# EAGLE design Nixie_Clock_LED_Board (EAGLE 9.6.2)

## Sheet 1 of 2
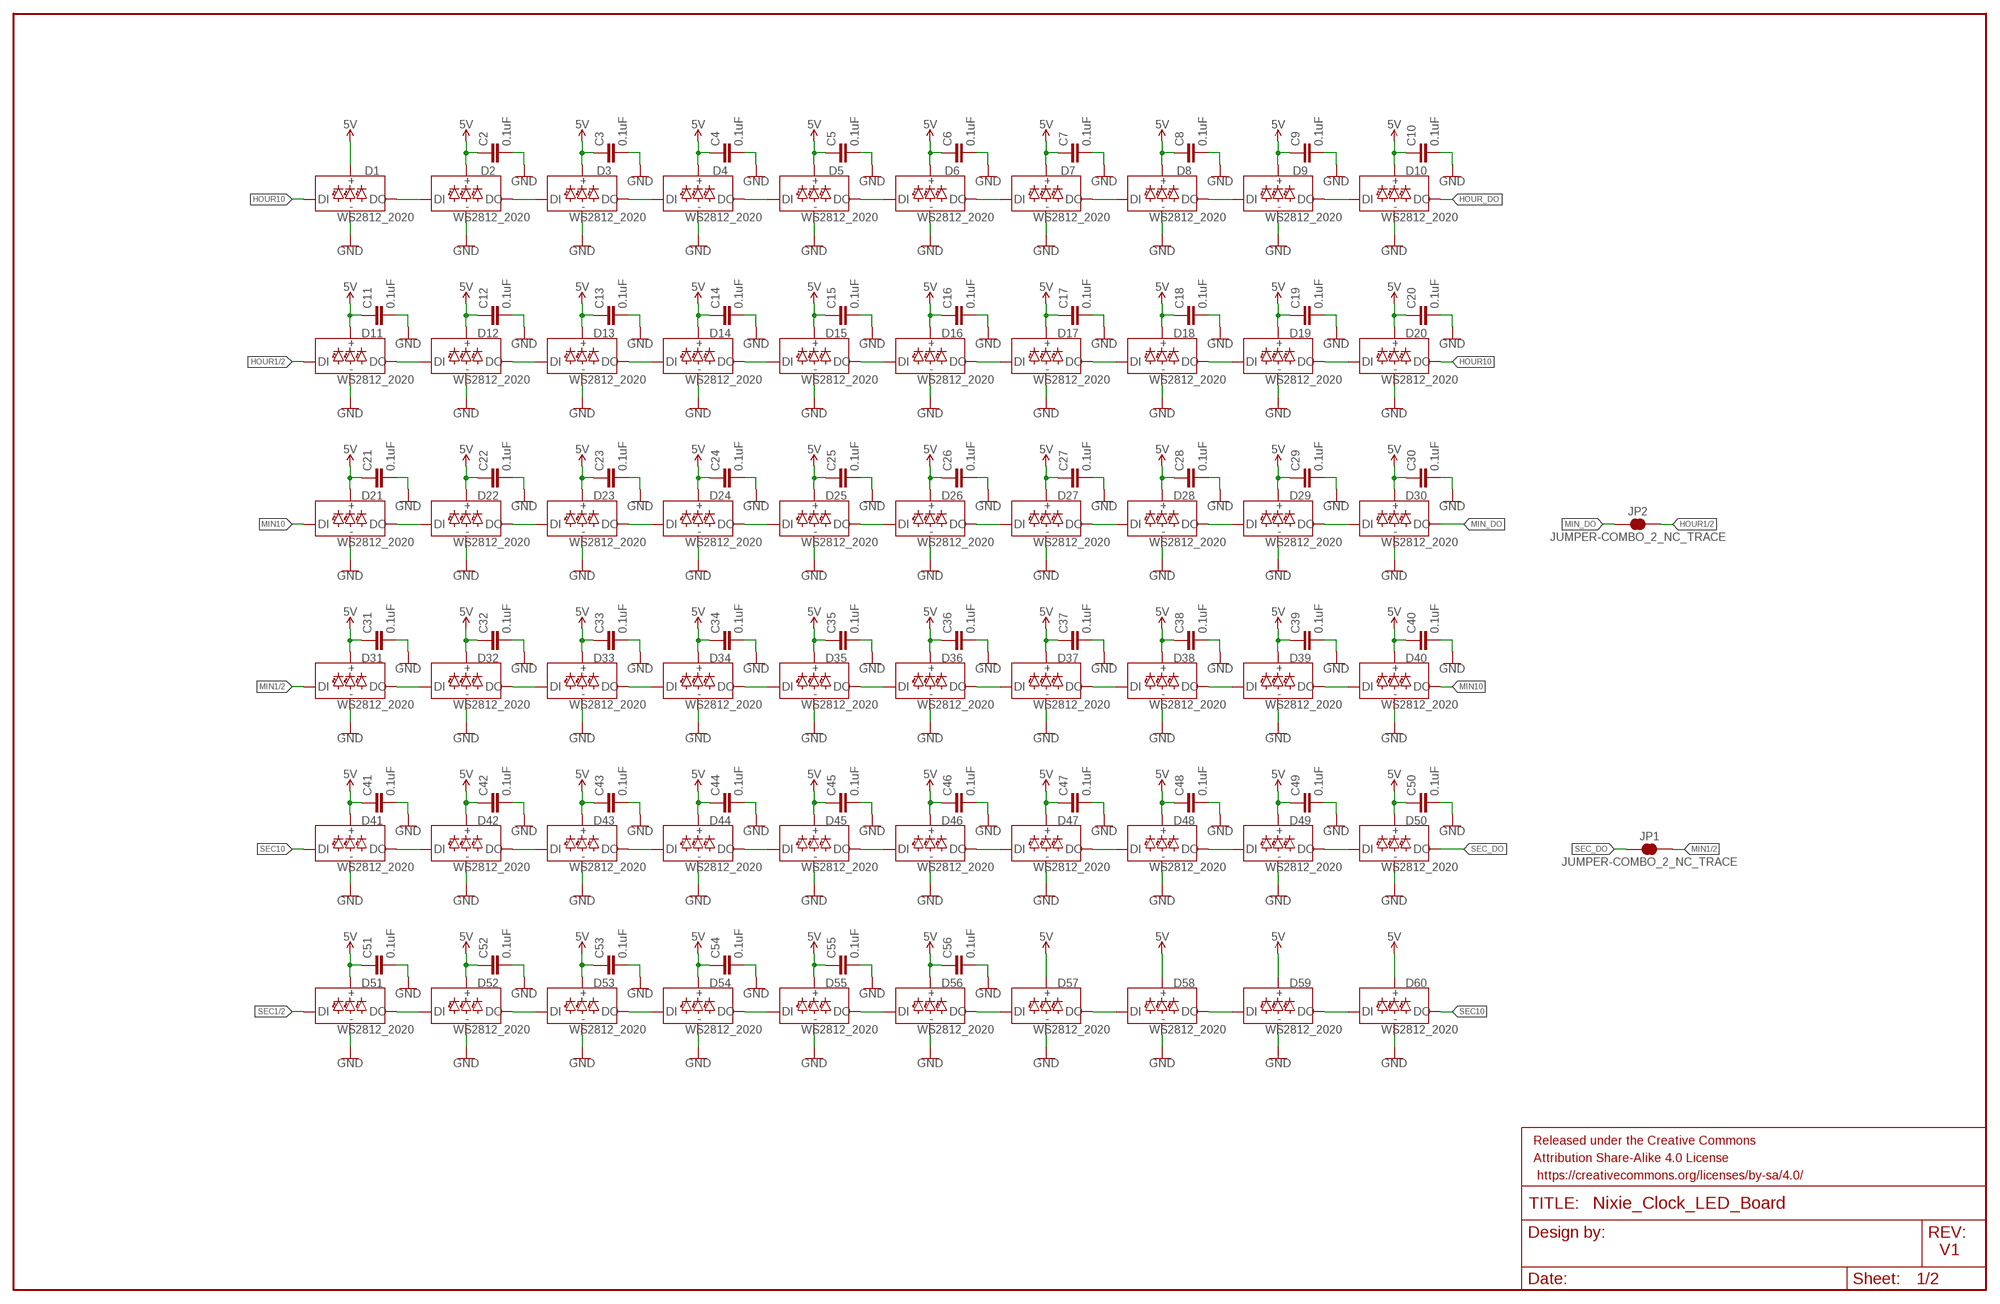
[diagram p0: schematic, sheet 1]

### Parts
C2  0.1uF  0.1UF-0603-25V-5%  [0603]
C3  0.1uF  0.1UF-0603-25V-5%  [0603]
C4  0.1uF  0.1UF-0603-25V-5%  [0603]
C5  0.1uF  0.1UF-0603-25V-5%  [0603]
C6  0.1uF  0.1UF-0603-25V-5%  [0603]
C7  0.1uF  0.1UF-0603-25V-5%  [0603]
C8  0.1uF  0.1UF-0603-25V-5%  [0603]
C9  0.1uF  0.1UF-0603-25V-5%  [0603]
C10  0.1uF  0.1UF-0603-25V-5%  [0603]
C11  0.1uF  0.1UF-0603-25V-5%  [0603]
C12  0.1uF  0.1UF-0603-25V-5%  [0603]
C13  0.1uF  0.1UF-0603-25V-5%  [0603]
C14  0.1uF  0.1UF-0603-25V-5%  [0603]
C15  0.1uF  0.1UF-0603-25V-5%  [0603]
C16  0.1uF  0.1UF-0603-25V-5%  [0603]
C17  0.1uF  0.1UF-0603-25V-5%  [0603]
C18  0.1uF  0.1UF-0603-25V-5%  [0603]
C19  0.1uF  0.1UF-0603-25V-5%  [0603]
C20  0.1uF  0.1UF-0603-25V-5%  [0603]
C21  0.1uF  0.1UF-0603-25V-5%  [0603]
C22  0.1uF  0.1UF-0603-25V-5%  [0603]
C23  0.1uF  0.1UF-0603-25V-5%  [0603]
C24  0.1uF  0.1UF-0603-25V-5%  [0603]
C25  0.1uF  0.1UF-0603-25V-5%  [0603]
C26  0.1uF  0.1UF-0603-25V-5%  [0603]
C27  0.1uF  0.1UF-0603-25V-5%  [0603]
C28  0.1uF  0.1UF-0603-25V-5%  [0603]
C29  0.1uF  0.1UF-0603-25V-5%  [0603]
C30  0.1uF  0.1UF-0603-25V-5%  [0603]
C31  0.1uF  0.1UF-0603-25V-5%  [0603]
C32  0.1uF  0.1UF-0603-25V-5%  [0603]
C33  0.1uF  0.1UF-0603-25V-5%  [0603]
C34  0.1uF  0.1UF-0603-25V-5%  [0603]
C35  0.1uF  0.1UF-0603-25V-5%  [0603]
C36  0.1uF  0.1UF-0603-25V-5%  [0603]
C37  0.1uF  0.1UF-0603-25V-5%  [0603]
C38  0.1uF  0.1UF-0603-25V-5%  [0603]
C39  0.1uF  0.1UF-0603-25V-5%  [0603]
C40  0.1uF  0.1UF-0603-25V-5%  [0603]
C41  0.1uF  0.1UF-0603-25V-5%  [0603]
C42  0.1uF  0.1UF-0603-25V-5%  [0603]
C43  0.1uF  0.1UF-0603-25V-5%  [0603]
C44  0.1uF  0.1UF-0603-25V-5%  [0603]
C45  0.1uF  0.1UF-0603-25V-5%  [0603]
C46  0.1uF  0.1UF-0603-25V-5%  [0603]
C47  0.1uF  0.1UF-0603-25V-5%  [0603]
C48  0.1uF  0.1UF-0603-25V-5%  [0603]
C49  0.1uF  0.1UF-0603-25V-5%  [0603]
C50  0.1uF  0.1UF-0603-25V-5%  [0603]
C51  0.1uF  0.1UF-0603-25V-5%  [0603]
C52  0.1uF  0.1UF-0603-25V-5%  [0603]
C53  0.1uF  0.1UF-0603-25V-5%  [0603]
C54  0.1uF  0.1UF-0603-25V-5%  [0603]
C55  0.1uF  0.1UF-0603-25V-5%  [0603]
C56  0.1uF  0.1UF-0603-25V-5%  [0603]
D1  WS2812_2020  [WS2812-2020]
D2  WS2812_2020  [WS2812-2020]
D3  WS2812_2020  [WS2812-2020]
D4  WS2812_2020  [WS2812-2020]
D5  WS2812_2020  [WS2812-2020]
D6  WS2812_2020  [WS2812-2020]
D7  WS2812_2020  [WS2812-2020]
D8  WS2812_2020  [WS2812-2020]
D9  WS2812_2020  [WS2812-2020]
D10  WS2812_2020  [WS2812-2020]
D11  WS2812_2020  [WS2812-2020]
D12  WS2812_2020  [WS2812-2020]
D13  WS2812_2020  [WS2812-2020]
D14  WS2812_2020  [WS2812-2020]
D15  WS2812_2020  [WS2812-2020]
D16  WS2812_2020  [WS2812-2020]
D17  WS2812_2020  [WS2812-2020]
D18  WS2812_2020  [WS2812-2020]
D19  WS2812_2020  [WS2812-2020]
D20  WS2812_2020  [WS2812-2020]
D21  WS2812_2020  [WS2812-2020]
D22  WS2812_2020  [WS2812-2020]
D23  WS2812_2020  [WS2812-2020]
D24  WS2812_2020  [WS2812-2020]
D25  WS2812_2020  [WS2812-2020]
D26  WS2812_2020  [WS2812-2020]
D27  WS2812_2020  [WS2812-2020]
D28  WS2812_2020  [WS2812-2020]
D29  WS2812_2020  [WS2812-2020]
D30  WS2812_2020  [WS2812-2020]
D31  WS2812_2020  [WS2812-2020]
D32  WS2812_2020  [WS2812-2020]
D33  WS2812_2020  [WS2812-2020]
D34  WS2812_2020  [WS2812-2020]
D35  WS2812_2020  [WS2812-2020]
D36  WS2812_2020  [WS2812-2020]
D37  WS2812_2020  [WS2812-2020]
D38  WS2812_2020  [WS2812-2020]
D39  WS2812_2020  [WS2812-2020]
D40  WS2812_2020  [WS2812-2020]
D41  WS2812_2020  [WS2812-2020]
D42  WS2812_2020  [WS2812-2020]
D43  WS2812_2020  [WS2812-2020]
D44  WS2812_2020  [WS2812-2020]
D45  WS2812_2020  [WS2812-2020]
D46  WS2812_2020  [WS2812-2020]
D47  WS2812_2020  [WS2812-2020]
D48  WS2812_2020  [WS2812-2020]
D49  WS2812_2020  [WS2812-2020]
D50  WS2812_2020  [WS2812-2020]
D51  WS2812_2020  [WS2812-2020]
D52  WS2812_2020  [WS2812-2020]
D53  WS2812_2020  [WS2812-2020]
D54  WS2812_2020  [WS2812-2020]
D55  WS2812_2020  [WS2812-2020]
D56  WS2812_2020  [WS2812-2020]
D57  WS2812_2020  [WS2812-2020]
D58  WS2812_2020  [WS2812-2020]
D59  WS2812_2020  [WS2812-2020]
D60  WS2812_2020  [WS2812-2020]
FRAME2  FRAME-LEDGER  [CREATIVE_COMMONS]
JP1  JUMPER-COMBO_2_NC_TRACE  [COMBO-JUMPER_2_NC_TRACE]
JP2  JUMPER-COMBO_2_NC_TRACE  [COMBO-JUMPER_2_NC_TRACE]

### Nets
5V: C2.1 C3.1 C4.1 C5.1 C6.1 C7.1 C8.1 C9.1 C10.1 C11.1 C12.1 C13.1 C14.1 C15.1 C16.1 C17.1 C18.1 C19.1 C20.1 C21.1 C22.1 C23.1 C24.1 C25.1 C26.1 C27.1 C28.1 C29.1 C30.1 C31.1 C32.1 C33.1 C34.1 C35.1 C36.1 C37.1 C38.1 C39.1 C40.1 C41.1 C42.1 C43.1 C44.1 C45.1 C46.1 C47.1 C48.1 C49.1 C50.1 C51.1 C52.1 C53.1 C54.1 C55.1 C56.1 D1.VCC D2.VCC D3.VCC D4.VCC D5.VCC D6.VCC D7.VCC D8.VCC D9.VCC D10.VCC D11.VCC D12.VCC D13.VCC D14.VCC D15.VCC D16.VCC D17.VCC D18.VCC D19.VCC D20.VCC D21.VCC D22.VCC D23.VCC D24.VCC D25.VCC D26.VCC D27.VCC D28.VCC D29.VCC D30.VCC D31.VCC D32.VCC D33.VCC D34.VCC D35.VCC D36.VCC D37.VCC D38.VCC D39.VCC D40.VCC D41.VCC D42.VCC D43.VCC D44.VCC D45.VCC D46.VCC D47.VCC D48.VCC D49.VCC D50.VCC D51.VCC D52.VCC D53.VCC D54.VCC D55.VCC D56.VCC D57.VCC D58.VCC D59.VCC D60.VCC ; also sheet 2
GND: C2.2 C3.2 C4.2 C5.2 C6.2 C7.2 C8.2 C9.2 C10.2 C11.2 C12.2 C13.2 C14.2 C15.2 C16.2 C17.2 C18.2 C19.2 C20.2 C21.2 C22.2 C23.2 C24.2 C25.2 C26.2 C27.2 C28.2 C29.2 C30.2 C31.2 C32.2 C33.2 C34.2 C35.2 C36.2 C37.2 C38.2 C39.2 C40.2 C41.2 C42.2 C43.2 C44.2 C45.2 C46.2 C47.2 C48.2 C49.2 C50.2 C51.2 C52.2 C53.2 C54.2 C55.2 C56.2 D1.GND D2.GND D3.GND D4.GND D5.GND D6.GND D7.GND D8.GND D9.GND D10.GND D11.GND D12.GND D13.GND D14.GND D15.GND D16.GND D17.GND D18.GND D19.GND D20.GND D21.GND D22.GND D23.GND D24.GND D25.GND D26.GND D27.GND D28.GND D29.GND D30.GND D31.GND D32.GND D33.GND D34.GND D35.GND D36.GND D37.GND D38.GND D39.GND D40.GND D41.GND D42.GND D43.GND D44.GND D45.GND D46.GND D47.GND D48.GND D49.GND D50.GND D51.GND D52.GND D53.GND D54.GND D55.GND D56.GND D57.GND D58.GND D59.GND D60.GND ; also sheet 2
HOUR1: D11.DI JP2.2 JP2.4 ; also sheet 2
HOUR10: D1.DI D20.DO
HOUR_DO: D10.DO
MIN1: D31.DI JP1.2 JP1.4 ; also sheet 2
MIN10: D21.DI D40.DO
MIN_DO: D30.DO JP2.1 JP2.3
N$1: D1.DO D2.DI
N$2: D2.DO D3.DI
N$3: D3.DO D4.DI
N$4: D4.DO D5.DI
N$5: D5.DO D6.DI
N$6: D6.DO D7.DI
N$7: D7.DO D8.DI
N$8: D8.DO D9.DI
N$9: D9.DO D10.DI
N$10: D11.DO D12.DI
N$11: D12.DO D13.DI
N$12: D13.DO D14.DI
N$13: D14.DO D15.DI
N$14: D15.DO D16.DI
N$15: D16.DO D17.DI
N$16: D17.DO D18.DI
N$17: D18.DO D19.DI
N$18: D19.DO D20.DI
N$19: D41.DO D42.DI
N$20: D21.DO D22.DI
N$21: D22.DO D23.DI
N$22: D23.DO D24.DI
N$23: D24.DO D25.DI
N$24: D25.DO D26.DI
N$25: D26.DO D27.DI
N$26: D27.DO D28.DI
N$27: D28.DO D29.DI
N$28: D29.DO D30.DI
N$29: D31.DO D32.DI
N$30: D32.DO D33.DI
N$31: D33.DO D34.DI
N$32: D34.DO D35.DI
N$33: D35.DO D36.DI
N$34: D36.DO D37.DI
N$35: D37.DO D38.DI
N$36: D38.DO D39.DI
N$37: D39.DO D40.DI
N$38: D42.DO D43.DI
N$39: D43.DO D44.DI
N$40: D44.DO D45.DI
N$41: D45.DO D46.DI
N$42: D46.DO D47.DI
N$43: D47.DO D48.DI
N$44: D48.DO D49.DI
N$45: D49.DO D50.DI
N$46: D51.DO D52.DI
N$47: D52.DO D53.DI
N$48: D53.DO D54.DI
N$49: D54.DO D55.DI
N$50: D55.DO D56.DI
N$51: D56.DO D57.DI
N$52: D57.DO D58.DI
N$53: D58.DO D59.DI
N$54: D59.DO D60.DI
SEC1: D51.DI ; also sheet 2
SEC10: D41.DI D60.DO
SEC_DO: D50.DO JP1.1 JP1.3

### Notes on the sheet
- V1

## Sheet 2 of 2
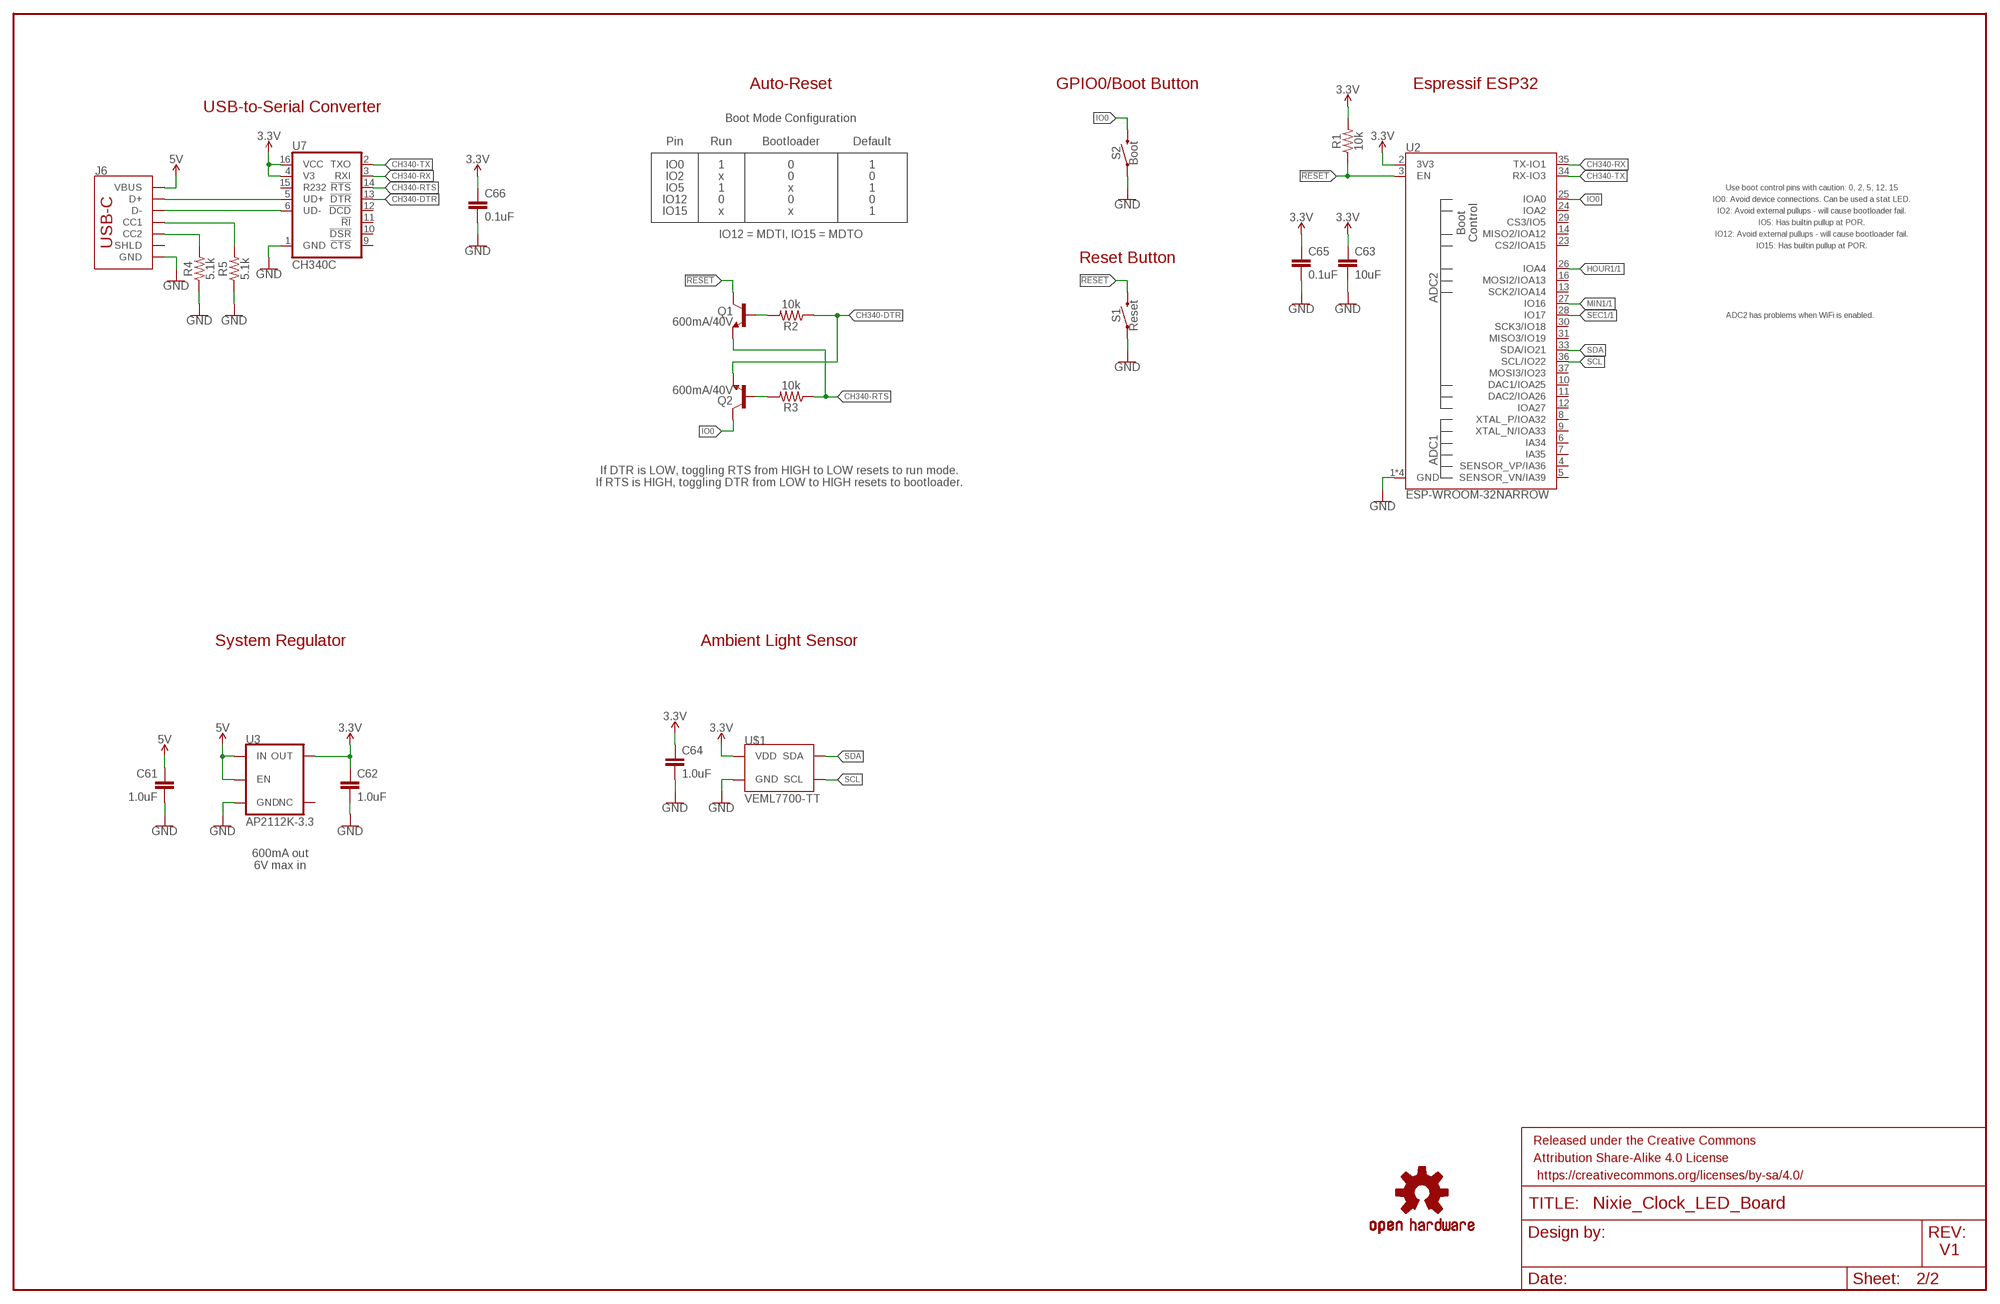
[diagram p1: schematic, sheet 2]

### Parts
C61  1.0uF  1.0UF-0603-16V-10%-X7R  [0603]
C62  1.0uF  1.0UF-0603-16V-10%-X7R  [0603]
C63  10uF  10UF-0603-6.3V-20%  [0603]
C64  1.0uF  1.0UF-0603-16V-10%-X7R  [0603]
C65  0.1uF  0.1UF-0603-25V-5%  [0603]
C66  0.1uF  0.1UF-0603-25V-5%  [0603]
FRAME1  FRAME-LEDGER  [CREATIVE_COMMONS]
J6  USB_C_2-LAYER_PADS  [USB-C-16P-2LAYER-PADS]
LOGO2  OSHW-LOGOL  [OSHW-LOGO-L]
Q1  600mA/40V  TRANS_NPN-MMBT2222AL  [SOT23-3]
Q2  600mA/40V  TRANS_NPN-MMBT2222AL  [SOT23-3]
R1  10k  10KOHM-0603-1/10W-1%  [0603]
R2  10k  10KOHM-0603-1/10W-1%  [0603]
R3  10k  10KOHM-0603-1/10W-1%  [0603]
R4  5.1k  5.1KOHM5.1KOHM-0603-1/10W-1%  [0603]
R5  5.1k  5.1KOHM5.1KOHM-0603-1/10W-1%  [0603]
S1  Reset  MOMENTARY-SWITCH-SPST-SMD-5.2MM-TALL  [TACTILE_SWITCH_SMD_5.2MM]
S2  Boot  MOMENTARY-SWITCH-SPST-SMD-5.2MM-TALL  [TACTILE_SWITCH_SMD_5.2MM]
U2  ESP-WROOM-32NARROW  [ESP-WROOM-32-NARROW]
U3  AP2112K-3.3  V_REG_AP2112K-3.3V  [SOT23-5]
U7  CH340C  [SO016]
U$1  VEML7700-TT  [VEML7700_TT]

### Nets
3.3V: C62.1 C63.1 C64.1 C65.1 C66.1 R1.2 U2.2(3V3) U3.5(OUT) U7.4(V3) U7.16(VCC) U$1.2(VDD)
5V: C61.1 J6.VBUS1(VBUS) J6.VBUS2(VBUS) U3.1(IN) U3.3(EN) ; also sheet 1
!RESET!: Q1.3(C) R1.1 S1.3 U2.3(EN)
CH340-DTR: Q2.2(E) R2.1 U7.13(!DTR)
CH340-RTS: Q1.2(E) R3.1 U7.14(!RTS)
CH340-RX: U2.35(TX-IO1) U7.3(RXI)
CH340-TX: U2.34(RX-IO3) U7.2(TXO)
D+: J6.A6(D+) J6.B6(D+) U7.5(UD+)
D-: J6.A7(D-) J6.B7(D-) U7.6(UD-)
GND: C61.2 C62.2 C63.2 C64.2 C65.2 C66.2 J6.GND J6.GND2(GND) R4.1 R5.1 S1.1 S2.1 U2.1(GND) U2.15(GND) U2.38(GND) U2.GND U3.2(GND) U7.1(GND) U$1.3(GND) ; also sheet 1
HOUR1: U2.26(IOA4) ; also sheet 1
IO0: Q2.3(C) S2.3 U2.25(IOA0)
MIN1: U2.27(IO16) ; also sheet 1
N$55: Q2.1(B) R3.2
N$56: Q1.1(B) R2.2
N$57: J6.B5(CC2) R4.2
N$58: J6.A5(CC1) R5.2
SCL: U2.36(SCL/IO22) U$1.1(SCL)
SDA: U2.33(SDA/IO21) U$1.4(SDA)
SEC1: U2.28(IO17) ; also sheet 1
Unconnected: J6.SHLD1(SHLD) J6.SHLD2(SHLD) J6.SHLD3(SHLD) J6.SHLD4(SHLD) U2.4(SENSOR_VP/IA36) U2.5(SENSOR_VN/IA39) U2.6(IA34) U2.7(IA35) U2.8(XTAL_P/IOA32) U2.9(XTAL_N/IOA33) U2.10(DAC1/IOA25) U2.11(DAC2/IOA26) U2.12(IOA27) U2.13(SCK2/IOA14) U2.14(MISO2/IOA12) U2.16(MOSI2/IOA13) U2.23(CS2/IOA15) U2.24(IOA2) U2.29(CS3/IO5) U2.30(SCK3/IO18) U2.31(MISO3/IO19) U2.37(MOSI3/IO23) U3.4(NC) U7.9(!CTS) U7.10(!DSR) U7.11(!RI) U7.12(!DCD) U7.15(R232)

### Notes on the sheet
- Auto-Reset | GPIO0/Boot Button | Espressif ESP32
- USB-to-Serial Converter
- Boot Mode Configuration
- Pin | Run | Bootloader | Default
- IO0 | 1 | 0 | 1
- IO2 | x | 0 | 0
- IO5 | 1 | x | 1 | Use boot control pins with caution: 0, 2, 5, 12, 15
- IO12 | 0 | 0 | 0 | IO0: Avoid device connections. Can be used a stat LED.
- IO15 | x | x | 1 | IO2: Avoid external pullups - will cause bootloader fail.
- IO5: Has builtin pullup at POR.
- IO12 = MDTI, IO15 = MDTO | IO12: Avoid external pullups - will cause bootloader fail.
- IO15: Has builtin pullup at POR.
- Reset Button
- ADC2 has problems when WiFi is enabled.
- If DTR is LOW, toggling RTS from HIGH to LOW resets to run mode.
  If RTS is HIGH, toggling DTR from LOW to HIGH resets to bootloader.
- System Regulator | Ambient Light Sensor
- 600mA out
  6V max in
- V1

## Library data of the parts
C2-C56 C65 C66 = SparkFun-Capacitors:0.1UF: 0.1µF ceramic capacitors A capacitor is a passive two-terminal electrical component used to store electrical energy temporarily in an electric field.; PROD_ID: CAP-08604
C61 C62 C64 = SparkFun-Capacitors:1.0UF: 1µF ceramic capacitors A capacitor is a passive two-terminal electrical component used to store electrical energy temporarily in an electric field.; PROD_ID: CAP-13930
C63 = SparkFun-Capacitors:10UF: 10.0µF ceramic capacitors A capacitor is a passive two-terminal electrical component used to store electrical energy temporarily in an electric field.; PROD_ID: CAP-11015
D1-D60 = SparkFun-LED:WS2812: Addressable RGB LED - 1 Wire Common names: WS2812, SK6812, Neopixel, APA-106, etc. SMD LED with built-in controller IC. Color: Red/Green/Blue SparkFun Products: LED-SMD RGB (WS2812) <https://www.sparkfun.com/products/11821> LED - RGB Addressable, PTH, 5mm Diffused (5 Pack) <https://www.sparkfun.com/products/12986> LED - RGB Addressable, PTH, 5mm Clear (5 Pack) <https://www.sparkfun.com/products/12999> Blynk Board - ESP8266 <https://www.sparkfun.com/products/13794> Datasheet referenced for footprint: WS2812B-PTH <https://cdn.sparkfun.com/datasheets/Components/LED/COM-12877.pdf>; PROD_ID: DIO-15591
FRAME1 FRAME2 = SparkFun-Aesthetics:FRAME-LEDGER: Schematic Frame - Ledger Standard 11x14 US Ledger frame
J6 = SparkFun-Connectors:USB_C: USB Type C 16Pin Connector Super Speed pins not available on the 16-pin purely SMD connector so this part is best for USB 2.0 implementations. D1 and D2 are tied together enabling D+/- no matter which way the cable is plugged into the connector. The two channel configuration pins (CC1/2) are exposed. These are normally connected to ground via 5.1k resistors but can be reconfigured for high current/high power applications. **4-LAYER BOARD WARNING!!** If designing 4-layer board, make sure to select the variant _4-LAYER-ISOLATED. The linked footprint (USB-C-16-4LAYER-ISOLATED) includes some very necessary cutout polygons in the inner layers (2 and 15). This prevents the PTH mounting shield legs on the USB connector from electrically connecting any other polygons on the inner layers (usually VCC and GND).; PROD_ID: CONN-14122
JP1 JP2 = SparkFun-Jumpers:JUMPER-COMBO_2_NC_TRACE
LOGO2 = SparkFun-Aesthetics:OSHW-LOGO: Open-Source Hardware (OSHW) Logo This logo indicates the piece of hardware it is found on incorporates a OSHW license and/or adheres to the definition of open source hardware found here: http://freedomdefined.org/OSHW
Q1 Q2 = SparkFun-DiscreteSemi:TRANS_NPN: NPN transistor Current controlled devices typically used to amplify current or used as a switch. BC547 - COM-08928 <http://www.sparkfun.com/products/8928> (TO-92 45V 100mA) (1.Collector 2.Base 3.Emitter) 2N3904 - COM-00521 <http://www.sparkfun.com/products/521> (TO-92 40V 200mA) (1.Emitter 2.Base 3.Collector) P2N2222A - COM-12852 <http://www.sparkfun.com/products/12852> (TO-92 40V 600mA) (1.Collector 2.Base 3.Emitter); PROD_ID: TRANS-08049
R1-R3 = SparkFun-Resistors:10KOHM: 10kΩ resistor A resistor is a passive two-terminal electrical component that implements electrical resistance as a circuit element. Resistors act to reduce current flow, and, at the same time, act to lower voltage levels within circuits. - Wikipedia; PROD_ID: RES-00824
R4 R5 = SparkFun-Resistors:5.1KOHM; PROD_ID: RES-12083
S1 S2 = SparkFun-Switches:MOMENTARY-SWITCH-SPST: Momentary Switch (Pushbutton) - SPST Normally-open (NO) SPST momentary switches (buttons, pushbuttons). Variants PTH-12MM - 12mm square, through-hole Momentary Pushbutton Switch - 12mm Square <https://www.sparkfun.com/products/9190> (COM-09190) PTH-6.0MM, PTH-6.0MM-KIT - 6.0mm square, through-hole Mini Pushbutton Switch <https://www.sparkfun.com/products/97> (COM-00097) KIT package intended for soldering kit's - only one side of pads' copper is exposed. PTH-RIGHT-ANGLE-KIT - Right-angle, through-hole Right Angle Tactile Button <https://www.sparkfun.com/products/10791> - Used on SparkFun BigTime Watch Kit <https://www.sparkfun.com/products/11734> SMD-12MM - 12mm square, surface-mount Tactile Button - SMD (12mm) <https://www.sparkfun.com/products/12993> (COM-12993) Used on SparkFun PicoBoard <https://www.sparkfun.com/products/11888> SMD-4.5MM - 4.5mm Square Trackball Switch Used on SparkFun Blackberry Trackballer Breakout <https://www.sparkfun.com/products/13169> SMD-4.6MMX2.8MM - 4.60mm x 2.80mm, surface mount Used on SparkFun Pro Micro - RP2040 <https://www.sparkfun.com/products/17717> SMD-5.2MM, SMD-5.2-REDUNDANT - 5.2mm square, surface-mount Mini Pushbutton Switch - SMD <https://www.sparkfun.com/products/8720> (COM-08720) Used on Arduino Pro Mini <https://www.sparkfun.com/products/11114> REDUNDANT package connects both switch circuits together SMD-6.0X3.5MM - 6.0 x 3.5mm, surface mount Momentary Reset Switch SMD <https://www.sparkfun.com/products/8229> (COM-08229) SMD-6.2MM-TALL - 6.2mm square, surface mount Tactile Button - SMD (6mm) <https://www.sparkfun.com/products/12992> Used on SparkFun Digital Sandbox <https://www.sparkfun.com/products/12651> SMD-RIGHT-ANGLE - Right-angle, surface mount Used on SparkFun Block for Intel® Edison - Arduino <https://www.sparkfun.com/products/13036>; PROD_ID: SWCH-14139
U2 = SparkFun-RF:ESP-WROOM-32; PROD_ID: IC-13849
U3 = SparkFun-IC-Power:V_REG_AP2112: AP2112 - 600mA CMOS LDO Regulator w/ Enable The AP2112 is CMOS process low dropout linear regulator with enable function, the regulator delivers a guaranteed 600mA (min.) continuous load current. Features Output Voltage Accuracy: ±1.5% Output Current: 600mA (Min.) Foldback Short Current Protection: 50mA Enable Function to Turn ON/OFF VOUT Low Dropout Voltage (3.3V): 250mV (Typ.) @IOUT=600mA Excellent Load Regulation: 0.2%/A (Typ.) Excellent Line Regulation: 0.02%/V (Typ.) Low Quiescent Current: 55μA (Typ.) Low Standby Current: 0.01μA (Typ.) Low Output Noise: 50μVRMS PSRR: 100Hz -65dB, 1kHz -65dB OTSD Protection Stable with 1.0μF Flexible Cap: Ceramic, Tantalum and Aluminum Electrolytic Operation Temperature Range: -40°C to 85°C ESD: MM 400V, HBM 4000V; PROD_ID: VREG-12457; VALUE: 3.3V
U7 = SparkFun-IC-Comms:CH340C; PROD_ID: IC-14038
U$1 = SparkFun-Sensors:VEML7700: Vishay VEML7700 Ambient Light Sensor VEML7700-TR is the side-view part VEML7700-TT is the top-view part; PROD_ID: IC-16311

## Net classes
1 power: width 0.305 mm, drill 0.305 mm

## Board
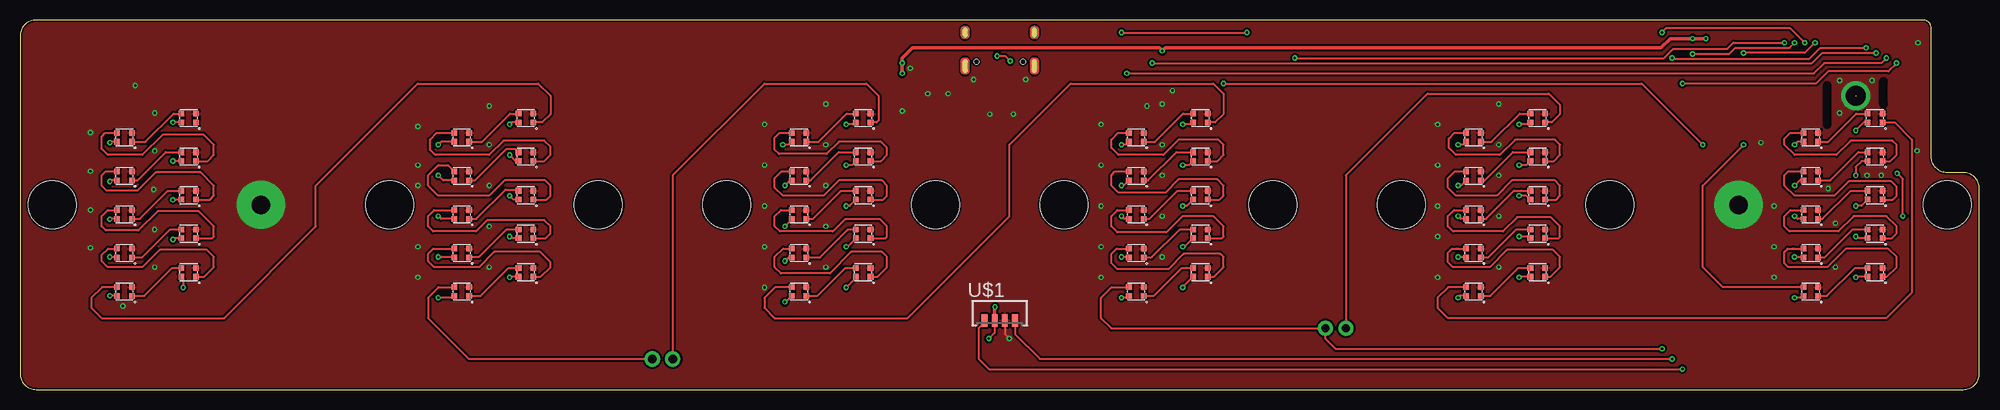
[diagram p2: board, top side]
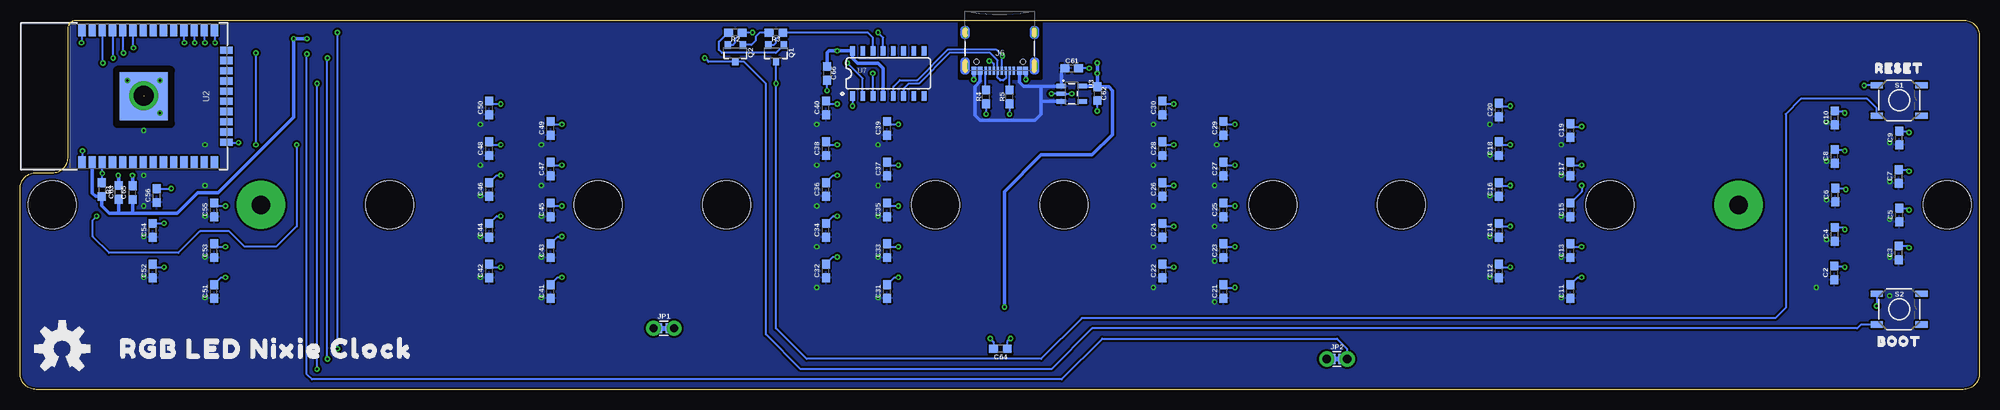
[diagram p3: board, bottom side, seen from below]

Size 244 x 46 mm. Coordinates in mm from the lower left corner, seen from the top.
Outline: 2,0 242,0 arc90 244,2 244,25 arc90 242,27 240,27 arc-90 238,29 238,45 arc90 237,46 2,46 arc90 0,44 0,2 arc90 2,0
Copper layers (1*16): Top 0.035mm / dielectric 1.5mm / Bottom 0.035mm
Design rules "SparkFun-2-Layer-General-JLCPCB": minimum track width 7mil, minimum drill 0.3mm, track to track 7mil, track to pad 7mil, pad to pad 7mil, via to via 7mil, smd to smd 7mil, copper to edge 7mil, drill to drill 7mil, minimum pad ring 7mil, minimum via ring 7mil, stop-mask expansion 3mil, vias tented up to drill 25mil, thermal gap 10mil
Holes 6 mm at 4,23 114,23 130,23 88,23 72,23 46,23 240,23 156,23 172,23 198,23
tRestrict: 2 lines
bRestrict: 4 lines

### Footprints (pad centres in the part's own frame; a part is rotated, then mirrored left to right if it is on the bottom)
0603 = smd 1.1 x 1: 1 -0.85,0; 2 0.85,0
WS2812-2020 = smd 0.7 x 0.7: DI -0.915,0.55; DO 0.915,-0.55; GND 0.915,0.55; VCC -0.915,-0.55
USB-C-16P-2LAYER-PADS = smd 0.3 x 1: A5 -1.25,-0.34; A6 -0.25,-0.34; A7 0.25,-0.34; A8 1.25,-0.34; B5 1.75,-0.34; B6 0.75,-0.34; B7 -0.75,-0.34; B8 -1.75,-0.34 | smd 0.6 x 1: GND -3.225,-0.34; GND2 3.225,-0.34; VBUS1 -2.45,-0.34; VBUS2 2.45,-0.34 | drill 0.4 pad 0.6 long: SHLD1 -4.318,-0.915; SHLD2 4.318,-0.915; SHLD3 -4.318,-5.095; SHLD4 4.318,-5.095 | hole 0.65: -2.89,-1.445; 2.89,-1.445
COMBO-JUMPER_2_NC_TRACE = smd 0.635 x 1.27: 1 -0.508,0; 2 0.508,0 | drill 1.016 pad 1.88: 3 -1.27,0; 4 1.27,0
SOT23-3 = smd 0.8 x 0.9: 1 -0.95,-1; 2 0.95,-1; 3 0,1.1
TACTILE_SWITCH_SMD_5.2MM = smd 1.524 x 0.762: 1 -2.794,1.905; 2 2.794,1.905; 3 -2.794,-1.905; 4 2.794,-1.905
ESP-WROOM-32-NARROW = smd 0.9 x 1.5: 1 6.43,8.238; 2 5.16,8.238; 3 3.89,8.238; 4 2.62,8.238; 5 1.35,8.238; 6 0.08,8.238; 7 -1.19,8.238; 8 -2.46,8.238; 9 -3.73,8.238; 10 -5,8.238; 11 -6.27,8.238; 12 -7.54,8.238; 13 -8.81,8.238; 14 -10.08,8.238; 25 -10.08,-8.238; 26 -8.81,-8.238; 27 -7.54,-8.238; 28 -6.27,-8.238; 29 -5,-8.238; 30 -3.73,-8.238; 31 -2.46,-8.238; 32 -1.19,-8.238; 33 0.08,-8.238; 34 1.35,-8.238; 35 2.62,-8.238; 36 3.89,-8.238; 37 5.16,-8.238; 38 6.43,-8.238 | smd 1.5 x 0.9: 15 -11.57,5.715; 16 -11.57,4.445; 17 -11.57,3.175; 18 -11.57,1.905; 19 -11.57,0.635; 20 -11.57,-0.635; 21 -11.57,-1.905; 22 -11.57,-3.175; 23 -11.57,-4.445; 24 -11.57,-5.715 | smd 6 x 6: GND -1.27,0
SOT23-5 = smd 0.55 x 1.2: 1 -0.95,-1.3; 2 0,-1.3; 3 0.95,-1.3; 4 0.95,1.3; 5 -0.95,1.3
SO016 = smd 0.6 x 1.2: 1 -4.445,-2.8; 2 -3.175,-2.8; 3 -1.905,-2.8; 4 -0.635,-2.8; 5 0.635,-2.8; 6 1.905,-2.8; 7 3.175,-2.8; 8 4.445,-2.8; 9 4.445,2.8; 10 3.175,2.8; 11 1.905,2.8; 12 0.635,2.8; 13 -0.635,2.8; 14 -1.905,2.8; 15 -3.175,2.8; 16 -4.445,2.8
VEML7700_TT = smd 0.7 x 1.6: 1 -1.905,-0.9; 2 -0.635,-0.9; 3 0.635,-0.9; 4 1.905,-0.9

### Placement (x,y rotation side)
C2  18.05,14.53 90 bottom
C3  10.03,17.03 90 bottom
C4  18.01,19.33 90 bottom
C5  9.99,21.73 90 bottom
C6  17.97,24.23 90 bottom
C7  10.05,26.53 90 bottom
C8  18.03,29.03 90 bottom
C9  10.01,31.33 90 bottom
C10  17.99,33.83 90 bottom
C11  50.94,12.21 90 bottom
C12  59.83,14.75 90 bottom
C13  50.94,17.29 90 bottom
C14  59.83,19.83 90 bottom
C15  50.94,22.37 90 bottom
C16  59.83,24.91 90 bottom
C17  50.94,27.45 90 bottom
C18  59.83,29.99 90 bottom
C19  50.94,32.26 90 bottom
C20  59.83,34.8 90 bottom
C21  94.12,12.21 90 bottom
C22  101.74,14.75 90 bottom
C23  94.12,17.29 90 bottom
C24  101.74,19.83 90 bottom
C25  94.12,22.37 90 bottom
C26  101.74,24.91 90 bottom
C27  94.12,27.45 90 bottom
C28  101.74,29.99 90 bottom
C29  94.12,32.53 90 bottom
C30  101.74,35.07 90 bottom
C31  136.03,12.21 90 bottom
C32  143.65,14.75 90 bottom
C33  136.03,17.29 90 bottom
C34  143.65,19.83 90 bottom
C35  136.03,22.37 90 bottom
C36  143.65,24.91 90 bottom
C37  136.03,27.45 90 bottom
C38  143.65,29.99 90 bottom
C39  136.03,32.53 90 bottom
C40  143.65,35.07 90 bottom
C41  177.94,12.21 90 bottom
C42  185.56,14.75 90 bottom
C43  177.94,17.29 90 bottom
C44  185.56,19.83 90 bottom
C45  177.94,22.37 90 bottom
C46  185.56,24.91 90 bottom
C47  177.94,27.45 90 bottom
C48  185.56,29.99 90 bottom
C49  177.94,32.53 90 bottom
C50  185.56,35.07 90 bottom
C51  219.85,12.21 90 bottom
C52  227.47,14.75 90 bottom
C53  219.85,17.29 90 bottom
C54  227.47,19.83 90 bottom
C55  219.85,22.37 90 bottom
C56  226.96,24.15 90 bottom
C61  113.03,40.01 0 bottom
C62  109.86,36.83 270 bottom
C63  231.74,24.56 90 bottom
C64  121.92,5.08 180 bottom
C65  230,24.51 90 bottom
C66  143.51,39.37 270 bottom
D1  13,12.2 0 top
D2  21,14.6 0 top
D3  13,17 0 top
D4  21,19.4 0 top
D5  13,21.8 0 top
D6  21,24.2 0 top
D7  13,26.6 0 top
D8  21,29 0 top
D9  13,31.4 0 top
D10  21,33.8 0 top
D11  55,12.2 0 top
D12  63,14.6 0 top
D13  55,17 0 top
D14  63,19.4 0 top
D15  55,21.8 0 top
D16  63,24.2 0 top
D17  55,26.6 0 top
D18  63,29 0 top
D19  55,31.4 0 top
D20  63,33.8 0 top
D21  97,12.2 0 top
D22  105,14.6 0 top
D23  97,17 0 top
D24  105,19.4 0 top
D25  97,21.8 0 top
D26  105,24.2 0 top
D27  97,26.6 0 top
D28  105,29 0 top
D29  97,31.4 0 top
D30  105,33.8 0 top
D31  139,12.2 0 top
D32  147,14.6 0 top
D33  139,17 0 top
D34  147,19.4 0 top
D35  139,21.8 0 top
D36  147,24.2 0 top
D37  139,26.6 0 top
D38  147,29 0 top
D39  139,31.4 0 top
D40  147,33.8 0 top
D41  181,12.2 0 top
D42  189,14.6 0 top
D43  181,17 0 top
D44  189,19.4 0 top
D45  181,21.8 0 top
D46  189,24.2 0 top
D47  181,26.6 0 top
D48  189,29 0 top
D49  181,31.4 0 top
D50  189,33.8 0 top
D51  223,12.2 0 top
D52  231,14.6 0 top
D53  223,17 0 top
D54  231,19.4 0 top
D55  223,21.8 0 top
D56  231,24.2 0 top
D57  223,26.6 0 top
D58  231,29 0 top
D59  223,31.4 0 top
D60  231,33.8 0 top
FRAME1  101.6,-10.16 0 top  (outside the outline)
FRAME2  101.6,-10.16 0 top  (outside the outline)
J6  122,39.37 180 bottom
JP1  163.83,7.62 0 bottom
JP2  80.01,3.81 0 bottom
LOGO2  238.76,5.08 0 bottom
Q1  149.86,41.91 180 bottom
Q2  154.94,41.91 180 bottom
R1  233.81,24.89 270 bottom
R2  154.94,44.45 180 bottom
R3  149.86,44.45 180 bottom
R4  123.7,36.45 90 bottom
R5  120.78,36.45 90 bottom
S1  10,36 0 bottom
S2  10,10 0 bottom
U2  229.87,36.51 180 bottom
U3  113.03,36.83 270 bottom
U7  135.89,39.37 0 bottom
U$1  122,9.5 0 top
U$2  [RESET0]  10,40 0 bottom
U$3  [BOOT0]  10,6 0 bottom
U$4  [RGB_LED_NIXIE_CLOCK0]  213.36,5.08 0 bottom

### Tracks (layer width: path | path; a pad name or v marks a point on that pad's centre or on a via)
3.3V  (via drill 0.3)
  Top 0.254: U$1.2 121.36,7.07 v120.65,6.35
  Top 0.406: v121.41,10.29 121.36,10.24 U$1.2 | v109.86,39.37 v109.86,40.64 109.86,41.27 111.12,42.55 141.87,42.55 v142.24,42.17 142.62,42.55 204.34,42.55 205.49,43.69 v208.28,43.69 v209.93,43.69
  Bottom 0.254: v120.65,6.35 121.07,5.93 C64.1
  Bottom 0.406: U3.5 109.95,37.78 | 109.95,37.78 C62.1 108.42,37.68 107.95,37.21 107.95,31.75 110.49,29.21 116.84,29.21 121.41,24.64 v121.41,10.29 | C66.1 143.51,41.91 143.25,42.17 v142.24,42.17 U7.16 140.34,41.27 139.7,40.64 137.16,40.64 136.53,40.01 U7.4 | 109.95,37.78 109.86,37.88 v109.86,39.37 v109.86,40.64 | U2.2 235.03,24.46 234.61,24.04 R1.2 233.81,22.86 232.92,21.97 231.78,21.97 | 231.78,21.97 230,21.97 | 230,21.97 224.41,21.97 221.87,24.51 219.33,24.51 209.93,33.91 v209.93,43.69 v208.28,43.69 | C63.1 231.74,22 231.78,21.97 | C65.1 230,21.97
5V  (via drill 0.3)
  Top 0.254: D51.VCC 221.87,11.43 v220.98,11.43 | D52.VCC 228.68,14.05 v228.6,13.97 | D53.VCC 221.04,16.45 v220.98,16.51 | D54.VCC 228.8,18.85 v228.6,19.05 | D55.VCC 221.32,21.25 v220.98,21.59 | D56.VCC 229.29,22.86 v228.6,22.86 | D57.VCC 221.63,26.05 v220.98,25.4 | D58.VCC 229.32,28.45 228.6,27.73 v228.6,26.67 | D59.VCC 221.35,30.85 v220.98,30.48 | D60.VCC 229.59,33.25 v228.6,32.26 | D41.VCC 179.29,11.65 v179.07,11.43 | D42.VCC 186.77,14.05 v186.69,13.97 | D43.VCC 179.13,16.45 v179.07,16.51 | D44.VCC 187.88,19.05 v186.69,19.05 | D45.VCC 179.41,21.25 v179.07,21.59 | D46.VCC 187.64,24.09 187.61,24.09 187.57,24.13 v186.69,24.13 | D47.VCC 179.44,25.4 v179.07,25.4 | D48.VCC 187.57,27.94 v186.69,27.94 | D49.VCC 179.72,30.48 v179.07,30.48 | D50.VCC 187.85,33.02 v186.69,33.02 | D31.VCC 137.87,11.43 v137.16,11.43 | D32.VCC 144.78,12.74 v144.78,12.7 | D33.VCC 137.22,16.45 v137.16,16.51 | D34.VCC 145.01,17.78 v144.78,17.78 | D35.VCC 137.5,21.25 v137.16,21.59 | D36.VCC 145.29,22.86 v144.78,22.86 | D37.VCC 137.44,25.4 v137.16,25.4 | D38.VCC 145.57,27.94 v144.78,27.94 | D39.VCC 137.72,30.48 v137.16,30.48 | D40.VCC 145.85,33.02 v144.78,33.02 | D21.VCC 95.36,10.92 v95.25,10.92 | D22.VCC 104.08,13.91 v102.87,12.7 | D23.VCC 95.7,16.45 v95.25,16 | D24.VCC 103.02,17.78 v102.87,17.78 | D25.VCC 96.08,21.16 v95.25,20.32 | D26.VCC 103.3,22.86 v102.87,22.86 | D27.VCC 95.9,26.05 v95.25,25.4 | D28.VCC 103.58,27.94 v102.87,27.94 | D29.VCC 95.72,30.48 v95,30.48 | D30.VCC 103.86,33.02 v102.87,33.02 | D11.VCC 53.87,11.43 v52.07,11.43 | D12.VCC 61.04,14.05 v60.96,13.97 | D13.VCC 52.13,16.45 v52.07,16.51 | D14.VCC 61.16,18.85 v60.96,19.05 | D15.VCC 52.41,21.25 v52.07,21.59
  Top 0.254: D16.VCC 61.44,23.65 v60.96,24.13 | D17.VCC 52.69,26.05 v52.07,26.67 | D18.VCC 61.72,28.45 v60.96,29.21 | D19.VCC 52.44,30.85 v52.07,30.48 | D20.VCC 61.19,33.25 v60.96,33.02 | D1.VCC 11.21,11.65 v11.18,11.68 | D2.VCC 20.32,13.81 v20.32,12.7 | D3.VCC 11.24,16.45 v11.18,16.51 | D4.VCC 19.23,18.85 v19.05,18.67 | D5.VCC 11.22,21.25 v11.18,21.21 | D6.VCC 19.08,23.65 v19.05,23.62 | D7.VCC 11.32,26.05 v11.18,25.91 | D8.VCC v19.05,28.45 | D9.VCC 11.29,30.85 v11.18,30.73 | D10.VCC 19.07,33.25 v19.05,33.27
  Bottom 0.406: J6.VBUS2 124.45,38.36 125.09,37.72 125.09,34.16 124.46,33.53 117.6,33.53 116.84,34.29 116.84,35.94 | J6.VBUS1 119.55,38.27 119.06,37.78 116.84,37.78 | 116.84,37.78 U3.1 114.33,39.55 C61.1 | 116.84,35.94 116.84,37.78 | U3.3 116.78,35.88 116.84,35.94
  pour Bottom (isolate 0.254): 0,0 0,46 244,46 243.84,0
  cutout Bottom: 116.84,45.72 116.84,38.73 127,38.73 127,45.72
!RESET!  (via drill 0.3)
  Top 0.254: v209.55,30.48 201.93,38.1 v149.86,38.1 | v234.47,21.59 234.47,26.21 v233.76,26.92
  Bottom 0.254: R1.1 233.76,25.79 v233.76,26.92 U2.3 | S1.3 12.79,35.02 13.97,36.2 22.23,36.2 24.13,34.29 24.13,10.16 25.4,8.89 111.76,8.89 116.84,3.81 146.05,3.81 149.86,7.62 v149.86,38.1 Q1.3 | v209.55,30.48 209.55,20.32 212.09,17.78 216.03,17.78 217.93,19.68 221.62,19.68 224.28,17.02 232.92,17.02 234.95,19.05 234.95,21.11 v234.47,21.59
CH340-DTR  (via drill 0.3)
  Top 0.254: v137.16,44.45 v152.78,44.45
  Bottom 0.254: U7.13 136.53,43.81 v137.16,44.45 | v152.78,44.45 R2.1 154.94,43.6 154.94,43.18 155.21,42.91 Q2.2
CH340-RTS
  Bottom 0.254: U7.14 137.79,43.81 138.43,44.45 R3.1 149.86,43.6 149.86,43.18 150.13,42.91 Q1.2
CH340-RX  (via drill 0.3)
  Top 0.254: v137.79,39.37 223.39,39.37 224.66,40.64 231.78,40.64 v232.41,41.27
  Bottom 0.254: U2.35 232.49,41.27 v232.41,41.27 | U7.3 v137.79,39.37
CH340-TX  (via drill 0.3)
  Top 0.254: v140.97,40.64 223.14,40.64 224.41,41.91 v231.14,41.91
  Bottom 0.254: U2.34 231.22,41.99 v231.14,41.91 | U7.2 139.06,38.73 v140.97,40.64
D+  (via drill 0.3)
  Top 0.254: v121.67,41.53 122.68,41.53 v123.32,40.89
  Bottom 0.254: J6.A6 121.75,41.45 v121.67,41.53 122.48,42.34 128.45,42.34 132.26,38.53 134.44,38.53 135.25,37.72 U7.5 | v123.32,40.89 123.06,40.89 122.75,40.58 J6.B6
D-
  Bottom 0.254: J6.B7 121.25,38.77 121.54,38.48 121.92,38.48 122.25,38.81 J6.A7 122.25,40.97 123.19,41.91 128.27,41.91 132.08,38.1 133.35,38.1 133.99,37.47 U7.6
GND  (via drill 0.3, 2.3 pad 6, 2.54)  (1 unrouted)
  Top 0.254: U$1.3 122.64,6.91 v123.19,6.35
  Bottom 0.254: C9.2 8.94,32.18 v8.76,32 | C7.2 8.96,27.38 v8.76,27.18 | C8.2 16.93,29.88 v16.76,29.72 | C10.2 17.03,34.68 v16.76,34.42 | C6.2 16.82,25.08 v16.64,24.89 | C5.2 8.99,22.58 v8.76,22.35 | C4.2 17,20.18 v16.76,19.94 | C3.2 8.99,17.88 v8.76,17.65 | C2.2 16.9,15.38 v16.76,15.24 | C11.2 50.03,13.97 v49.53,13.97 | C13.2 50.58,17.78 v49.53,17.78 | C12.2 59.47,15.24 v58.42,15.24 | C14.2 59.47,20.32 v58.42,20.32 | C15.2 49.53,24.63 v49.53,25.4 | C16.2 59.47,25.4 v58.42,25.4 | C17.2 50.58,27.94 v49.53,27.94 | C19.2 50.58,32.75 v49.53,32.75 | C18.2 59.47,30.48 v58.42,30.48 | C20.2 59.47,35.29 v58.42,35.29 | C21.2 93.76,12.7 v92.71,12.7 | C23.2 93.76,17.78 v92.71,17.78 | C25.2 93.76,22.86 v92.71,22.86 | C27.2 93.76,27.94 v92.71,27.94 | C29.2 93.76,33.02 v92.71,33.02 | C30.2 101.38,35.56 v100.33,35.56 | C28.2 101.38,30.48 v100.33,30.48 | C26.2 101.38,25.4 v100.33,25.4 | C24.2 101.38,20.32 v100.33,20.32 | C22.2 101.38,15.24 v100.33,15.24 | C31.2 135.12,13.97 v134.62,13.97 | C33.2 135.67,17.78 v134.62,17.78 | C35.2 135.67,22.86 v134.62,22.86 | C37.2 135.67,27.94 v134.62,27.94 | C39.2 135.67,33.02 v134.62,33.02 | C40.2 143.29,35.56 v142.24,35.56 | C38.2 143.29,30.48 v142.24,30.48 | C36.2 142.74,26.67 v142.24,26.67 | C34.2 142.74,21.59 v142.24,21.59 | C32.2 142.74,16.51 v142.24,16.51 | C41.2 177.03,13.97 v176.53,13.97 | C43.2 177.03,19.05 v176.53,19.05 | C45.2 177.58,22.86 v176.53,22.86 | C47.2 177.58,27.94 v176.53,27.94 | C49.2 177.58,33.02 v176.53,33.02 | C42.2 185.2,15.24 v184.15,15.24 | C44.2 184.65,21.59 v184.15,21.59 | C46.2 184.65,26.67 v184.15,26.67 | C48.2 185.2,30.48 v184.15,30.48 | C50.2 185.2,35.56 v184.15,35.56 | C51.2 218.94,13.97 v218.44,13.97
  Bottom 0.254: C53.2 219.49,17.78 v218.44,17.78 | C55.2 219.49,22.86 v218.44,22.86 | C56.2 226.94,25.02 v225.17,25.02 | C54.2 227.45,20.7 v226.06,20.7 | C52.2 227.11,15.24 v226.06,15.24 | U2.15 218.24,30.73 v216.79,30.73 | U2.1 236.22,28.36 v236.22,29.72 | U2.38 236.3,43.23 v236.35,43.18 | v226.57,38.48 226.63,38.48 | 226.57,34.54 v226.57,34.42 | v230.63,38.48 230.57,38.48 | U7.1 v140.34,35.31 | R5.1 v120.78,34.29 | R4.1 v123.7,34.29 | v109.86,34.67 C62.2 | v113.03,36.83 U3.2 v115.57,36.83 | v110.87,40.01 C61.2 | v143.51,37.21 C66.2 | v123.19,6.35 122.77,5.93 C64.2 | S2.1 12.79,10.45 v12.83,10.41 | S1.1 14.29,37.91 v14.35,37.85
  Bottom 0.406: v118.75,38.61 118.75,39.68 J6.GND | v125.22,38.61 J6.GND2 | C63.2 231.74,26.64 v231.78,26.67 | C65.2 v230,26.67
  other vias: 30,23 214,23 228.6,36.58
  pour Top (isolate 0.254): 0,0 0,46 244,46 244,0
HOUR1  (via drill 0.3)
  Top 0.254: D11.DI 52.12,12.75 50.8,11.43 50.8,8.89 55.88,3.81 JP2.4 | v220.98,43.18 220.35,42.55 213.62,42.55 212.85,41.78 v208.28,41.78
  Bottom 0.254: JP2.2 JP2.4 78.74,5.08 80.01,6.35 109.22,6.35 114.3,1.27 207.65,1.27 208.28,1.91 v208.28,41.78 | v220.98,43.18 220.98,44.67 U2.26
HOUR10
  Top 0.254: D1.DI 10.21,12.75 8.89,11.43 8.89,10.16 10.16,8.89 25.4,8.89 36.83,20.32 36.83,25.4 49.51,38.08 64.52,38.08 66.04,36.56 66.04,34.29 65,33.25 D20.DO
IO0  (via drill 0.3)
  Top 0.254: v219.71,43.18 213.36,43.18 212.6,42.42 205.87,42.42 204.72,41.27 v158.75,41.27
  Bottom 0.254: U2.25 219.79,43.26 v219.71,43.18 | S2.3 14.77,8.1 15.24,7.62 110.49,7.62 115.57,2.54 146.81,2.54 151.13,6.86 151.13,38.1 153.84,40.81 Q2.3 158.28,40.81 v158.75,41.27
MIN1  (via drill 0.3)
  Top 0.254: D31.DI 135.94,12.75 134.62,11.43 134.62,8.89 135.89,7.62 JP1.4 162.56,6.35 163.83,5.08 v204.47,5.08 | v204.47,44.45 204.98,44.96 220.47,44.96 v222.25,43.18
  Bottom 0.254: JP1.4 JP1.2 | v204.47,5.08 v204.47,44.45 | v222.25,43.18 222.25,44.67 U2.27
MIN10
  Top 0.254: D21.DI 94.03,12.75 92.71,11.43 92.71,10.16 93.98,8.89 110.49,8.89 123.19,21.59 123.19,30.48 130.81,38.1 148.59,38.1 149.86,36.83 149.86,34.29 148.82,33.25 D40.DO
MIN_DO
  Top 0.254: D30.DO 106.66,33.25 106.93,33.53 106.93,36.58 105.41,38.1 92.71,38.1 81.28,26.67 JP2.3
  Bottom 0.254: JP2.3 JP2.1
N$1
  Top 0.254: D1.DO 15.46,11.65 18.96,15.15 D2.DI
N$2
  Top 0.254: D2.DO 22.94,14.05 24.13,15.24 24.13,16.51 23.24,17.4 17.4,17.4 15.24,15.24 10.92,15.24 10.16,16 10.16,16.76 10.95,17.55 D3.DI
N$3
  Top 0.254: D3.DO 15.18,16.45 18.68,19.95 D4.DI
N$4
  Top 0.254: D4.DO 23.93,18.85 24.13,19.05 24.13,20.32 22.23,22.23 17.14,22.23 14.73,19.81 10.67,19.81 10.16,20.32 10.16,21.59 10.92,22.35 D5.DI
N$5
  Top 0.254: D5.DO 14.9,21.25 18.4,24.75 D6.DI
N$6
  Top 0.254: D6.DO 23.65,23.65 24.13,24.13 24.13,25.4 22.48,27.05 16.89,27.05 14.61,24.77 10.79,24.77 10.16,25.4 10.16,26.67 10.64,27.15 D7.DI
N$7
  Top 0.254: D7.DO 14.62,26.05 18.12,29.55 D8.DI
N$8
  Top 0.254: D8.DO 23.37,28.45 24.13,29.21 24.13,30.48 22.86,31.75 17.78,31.75 15.24,29.21 10.92,29.21 10.16,29.97 10.16,31.5 10.61,31.95 D9.DI
N$9
  Top 0.254: D9.DO 15.61,30.85 19.11,34.35 D10.DI
N$10
  Top 0.254: D11.DO 57.37,11.65 60.87,15.15 D12.DI
N$11
  Top 0.254: D12.DO 64.85,14.05 66.04,15.24 66.04,15.88 64.77,17.14 59.05,17.14 57.15,15.24 51.56,15.24 50.8,16 50.8,16.89 51.46,17.55 D13.DI
N$12
  Top 0.254: D13.DO 55.98,16.51 57.15,16.51 60.59,19.95 D14.DI
N$13
  Top 0.254: D14.DO 65.46,18.85 66.04,19.43 66.04,20.32 65.28,21.08 58.17,21.08 56.77,19.68 51.44,19.68 50.8,20.32 50.8,21.59 51.56,22.35 D15.DI
N$14
  Top 0.254: D15.DO 56.81,21.25 60.45,24.89 61.94,24.89 D16.DI
N$15
  Top 0.254: D16.DO 65.56,23.65 66.04,24.13 66.04,25.4 65.41,26.04 60.33,26.04 58.42,24.13 52.07,24.13 50.8,25.4 50.8,26.67 52.07,27.94 53.3,27.94 D17.DI
N$16
  Top 0.254: D17.DO 56.66,26.05 60.58,29.97 61.66,29.97 D18.DI
N$17
  Top 0.254: D18.DO 65.28,28.45 66.04,29.21 66.04,30.23 65.28,30.99 60.2,30.99 58.42,29.21 51.69,29.21 51.05,29.84 51.05,31.11 51.89,31.95 D19.DI
N$18
  Top 0.254: D19.DO 57.52,30.85 61.02,34.35 D20.DI
N$19
  Top 0.254: D41.DO 183.1,11.65 186.6,15.15 D42.DI
N$20
  Top 0.254: D21.DO 99.28,11.65 102.78,15.15 D22.DI
N$21
  Top 0.254: D22.DO 106.76,14.05 107.95,15.24 107.95,16.51 107.31,17.14 103.5,17.14 100.84,14.48 94.74,14.48 93.98,15.24 93.98,16.51 95.02,17.55 D23.DI
N$22
  Top 0.254: D23.DO 99.64,16.45 103.14,19.95 D24.DI
N$23
  Top 0.254: D24.DO 107.75,18.85 107.95,19.05 107.95,20.32 107.06,21.21 102.74,21.21 101.22,19.68 94.61,19.68 93.98,20.32 93.98,21.59 94.74,22.35 D25.DI
N$24
  Top 0.254: D25.DO 98.72,21.25 102.22,24.75 D26.DI
N$25
  Top 0.254: D26.DO 107.47,23.65 107.95,24.13 107.95,25.4 107.31,26.04 101.98,26.04 100.08,24.13 95,24.13 93.98,25.15 93.98,26.29 94.84,27.15 D27.DI
N$26
  Top 0.254: D27.DO 98.44,26.05 101.94,29.55 D28.DI
N$27
  Top 0.254: D28.DO 107.19,28.45 107.95,29.21 107.95,30.1 107.19,30.86 101.98,30.86 100.46,29.34 94.49,29.34 93.98,29.84 93.98,31.37 94.56,31.95 D29.DI
N$28
  Top 0.254: D29.DO 99.43,30.85 102.93,34.35 D30.DI
N$29
  Top 0.254: D31.DO 141.19,11.65 144.69,15.15 D32.DI
N$30
  Top 0.254: D32.DO 148.67,14.05 149.86,15.24 149.86,16.51 149.48,16.89 144.91,16.89 143,14.99 136.65,14.99 135.89,15.75 135.89,16.89 136.55,17.55 D33.DI
N$31
  Top 0.254: D33.DO 140.91,16.45 144.41,19.95 D34.DI
N$32
  Top 0.254: D34.DO 149.66,18.85 149.86,19.05 149.86,20.32 148.59,21.59 144.78,21.59 142.75,19.56 136.65,19.56 135.89,20.32 135.89,21.59 136.65,22.35 D35.DI
N$33
  Top 0.254: D35.DO 140.63,21.25 144.13,24.75 D36.DI
N$34
  Top 0.254: D36.DO 149.38,23.65 149.86,24.13 149.86,25.4 149.1,26.16 144.27,26.16 142.62,24.51 136.78,24.51 135.89,25.4 135.89,26.67 136.37,27.15 D37.DI
N$35
  Top 0.254: D37.DO 140.48,26.05 143.98,29.55 D38.DI
N$36
  Top 0.254: D38.DO 149.1,28.45 149.86,29.21 149.86,30.48 149.22,31.11 144.27,31.11 142.37,29.21 136.78,29.21 135.89,30.1 135.89,31.11 136.72,31.95 D39.DI
N$37
  Top 0.254: D39.DO 141.34,30.85 144.84,34.35 D40.DI
N$38
  Top 0.254: D42.DO 190.58,14.05 191.77,15.24 191.77,16.51 190.88,17.4 185.17,17.4 183.01,15.24 178.44,15.24 177.8,15.88 177.8,17.02 178.33,17.55 178.84,17.55 179.07,17.55 D43.DI
N$39
  Top 0.254: D43.DO 182.82,16.45 186.32,19.95 D44.DI
N$40
  Top 0.254: D44.DO 191.57,18.85 191.77,19.05 191.77,20.32 190.63,21.46 186.44,21.46 184.66,19.68 178.44,19.68 177.8,20.32 177.8,21.59 178.56,22.35 D45.DI
N$41
  Top 0.254: D45.DO 182.54,21.25 186.05,24.76 186.95,24.76 186.97,24.75 D46.DI
N$42
  Top 0.254: D46.DO 191.29,23.65 191.77,24.13 191.77,25.4 191.13,26.04 185.8,26.04 183.9,24.13 178.82,24.13 177.8,25.15 177.8,26.29 178.66,27.15 D47.DI
N$43
  Top 0.254: D47.DO 182.39,26.05 185.89,29.55 D48.DI
N$44
  Top 0.254: D48.DO 191.01,28.45 191.77,29.21 191.77,30.48 191.13,31.11 186.18,31.11 184.28,29.21 178.82,29.21 177.93,30.1 177.93,31.24 178.63,31.95 D49.DI
N$45
  Top 0.254: D49.DO 183.25,30.85 186.75,34.35 D50.DI
N$46
  Top 0.254: D51.DO 225.01,11.65 228.51,15.15 D52.DI
N$47
  Top 0.254: D52.DO 232.49,14.05 233.68,15.24 233.68,16.51 232.66,17.53 227.33,17.53 225.04,15.24 220.22,15.24 219.71,15.75 219.71,17.14 220.12,17.55 220.75,17.55 220.98,17.55 D53.DI
N$48
  Top 0.254: D53.DO 224.73,16.45 228.23,19.95 D54.DI
N$49
  Top 0.254: D54.DO 233.1,18.85 233.68,19.43 233.68,20.32 232.41,21.59 228.35,21.59 226.44,19.68 220.34,19.68 219.71,20.32 219.71,21.59 220.47,22.35 D55.DI
N$50
  Top 0.254: D55.DO 224.45,21.25 227.95,24.75 D56.DI
N$51
  Top 0.254: D56.DO 233.2,23.65 233.68,24.13 233.68,25.27 233.04,25.91 227.71,25.91 225.93,24.13 220.98,24.13 219.71,25.4 219.71,26.67 220.19,27.15 D57.DI
N$52
  Top 0.254: D57.DO 225.44,26.05 228.94,29.55 D58.DI
N$53
  Top 0.254: D58.DO 232.92,28.45 233.68,29.21 233.68,30.48 233.17,30.99 227.97,30.99 226.19,29.21 220.98,29.21 219.71,30.48 219.71,31.24 220.42,31.95 D59.DI
N$54
  Top 0.254: D59.DO 225.16,30.85 228.66,34.35 D60.DI
N$55
  Bottom 0.254: R3.2 151.89,44.45 152.4,43.94 152.4,43.43 152.92,42.91 Q2.1
N$56
  Bottom 0.254: Q1.1 148.91,42.86 149.86,41.91 156.59,41.91 156.97,42.29 156.97,43.31 155.83,44.45 R2.2
N$57
  Bottom 0.254: R4.2 123.75,37.35 J6.B5
N$58
  Bottom 0.254: R5.2 120.78,39.68 J6.A5
SCL  (via drill 0.3)
  Top 0.254: U$1.1 120.09,8.34 119.38,7.62 119.38,3.81 120.65,2.54 v207.01,2.54 | v233.68,40.64 232.66,39.62 225.17,39.62 223.65,38.1 v207.01,38.1
  Bottom 0.254: U2.36 233.76,40.72 v233.68,40.64 | v207.01,2.54 v207.01,38.1
SDA  (via drill 0.3)
  Top 0.254: U$1.4 123.91,6.91 127,3.81 v205.74,3.81 | v205.74,41.27 205.87,41.15 222.76,41.15 224.16,42.55 v229.87,42.55
  Bottom 0.254: U2.33 229.95,42.55 v229.87,42.55 | v205.74,3.81 v205.74,41.27
SEC1  (via drill 0.3)
  Top 0.254: v223.52,43.18 222.25,41.91 v214.63,41.91 | D51.DI 212.04,12.75 209.55,15.24 209.55,25.4 v214.63,30.48
  Bottom 0.254: U2.28 223.6,43.26 v223.52,43.18 | v214.63,41.91 v214.63,30.48
SEC10
  Top 0.254: D41.DI 177.85,12.75 176.53,11.43 176.53,10.16 177.8,8.89 232.41,8.89 235.59,12.06 235.59,31.11 233.45,33.25 D60.DO
SEC_DO
  Top 0.254: D50.DO 190.73,33.25 191.77,34.29 191.77,35.43 190.37,36.83 175.26,36.83 165.1,26.67 JP1.3
  Bottom 0.254: JP1.3 JP1.1